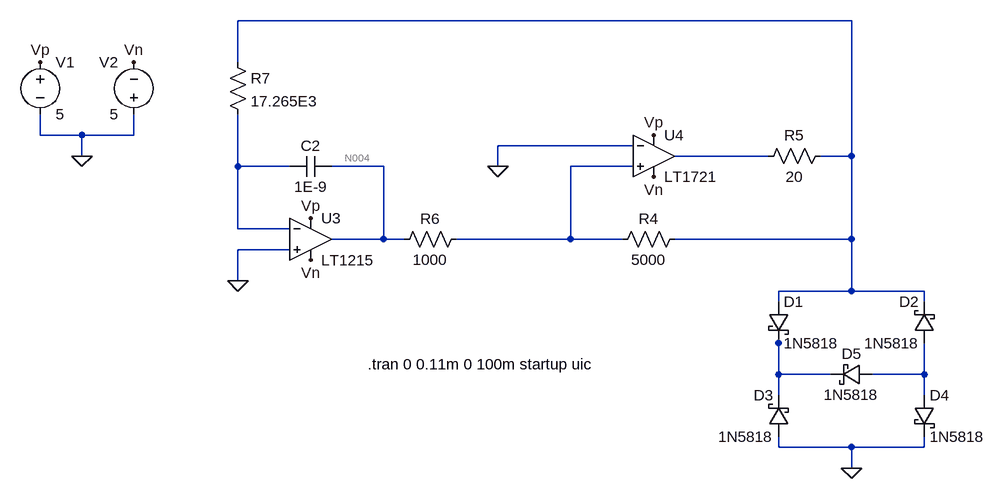
[diagram p0: schematic multivibrator.asc]
multivibrator.asc, the LTspice schematic file:
Version 4
SHEET 1 2040 680
WIRE 784 -80 -160 -80
WIRE -160 -16 -160 -80
WIRE -464 96 -464 64
WIRE -400 96 -464 96
WIRE -320 96 -320 64
WIRE -320 96 -400 96
WIRE 448 112 240 112
WIRE -400 128 -400 96
WIRE 656 128 512 128
WIRE 784 128 784 -80
WIRE 784 128 736 128
WIRE -160 144 -160 64
WIRE -80 144 -160 144
WIRE 64 144 -16 144
WIRE 240 144 240 112
WIRE 448 144 352 144
WIRE -160 240 -160 144
WIRE -80 240 -160 240
WIRE 64 256 64 144
WIRE 64 256 -16 256
WIRE 96 256 64 256
WIRE 352 256 352 144
WIRE 352 256 176 256
WIRE 432 256 352 256
WIRE 784 256 784 128
WIRE 784 256 512 256
WIRE -80 272 -160 272
WIRE -160 320 -160 272
WIRE 784 336 784 256
WIRE 784 336 672 336
WIRE 896 336 784 336
WIRE 672 352 672 336
WIRE 896 352 896 336
WIRE 672 416 672 400
WIRE 672 464 672 416
WIRE 752 464 672 464
WIRE 896 464 896 416
WIRE 896 464 816 464
WIRE 672 496 672 464
WIRE 896 496 896 464
WIRE 672 576 672 560
WIRE 784 576 672 576
WIRE 896 576 896 560
WIRE 896 576 784 576
WIRE 784 608 784 576
FLAG -400 128 0
FLAG -464 -16 Vp
FLAG -320 -16 Vn
FLAG 240 144 0
FLAG -160 320 0
FLAG -48 224 Vp
FLAG 480 96 Vp
FLAG -48 288 Vn
FLAG 480 160 Vn
FLAG 784 608 0
SYMBOL voltage -464 -32 R0
SYMATTR InstName V1
SYMATTR Value 5
SYMBOL voltage -320 80 R180
WINDOW 0 24 96 Left 2
WINDOW 3 24 16 Left 2
SYMATTR InstName V2
SYMATTR Value 5
SYMBOL res 528 240 R90
WINDOW 0 0 56 VBottom 2
WINDOW 3 32 56 VTop 2
SYMATTR InstName R4
SYMATTR Value 5000
SYMBOL res 752 112 R90
WINDOW 0 0 56 VBottom 2
WINDOW 3 32 56 VTop 2
SYMATTR InstName R5
SYMATTR Value 20
SYMBOL res 192 240 R90
WINDOW 0 0 56 VBottom 2
WINDOW 3 32 56 VTop 2
SYMATTR InstName R6
SYMATTR Value 1000
SYMBOL Opamps\\LT1215 -48 192 R0
SYMATTR InstName U3
SYMBOL cap -16 128 R90
WINDOW 0 0 32 VBottom 2
WINDOW 3 32 32 VTop 2
SYMATTR InstName C2
SYMATTR Value 1E-9
SYMBOL res -176 -32 R0
SYMATTR InstName R7
SYMATTR Value 17.265E3
SYMBOL schottky 656 352 R0
SYMATTR InstName D1
SYMATTR Value 1N5818
SYMATTR Description Diode
SYMATTR Type diode
SYMBOL schottky 912 416 R180
WINDOW 0 24 64 Left 2
WINDOW 3 24 0 Left 2
SYMATTR InstName D2
SYMATTR Value 1N5818
SYMATTR Description Diode
SYMATTR Type diode
SYMBOL schottky 688 560 R180
WINDOW 0 24 64 Left 2
WINDOW 3 24 0 Left 2
SYMATTR InstName D3
SYMATTR Value 1N5818
SYMATTR Description Diode
SYMATTR Type diode
SYMBOL schottky 880 496 R0
SYMATTR InstName D4
SYMATTR Value 1N5818
SYMATTR Description Diode
SYMATTR Type diode
SYMBOL schottky 816 448 R90
WINDOW 0 0 32 VBottom 2
WINDOW 3 32 32 VTop 2
SYMATTR InstName D5
SYMATTR Value 1N5818
SYMATTR Description Diode
SYMATTR Type diode
SYMBOL Comparators\\LT1721 480 64 R0
SYMATTR InstName U4
TEXT 40 448 Left 2 !.tran 0 0.11m 0 100m startup uic

The netlist it stands for:
* multivibrator.asc
V1 Vp 0 5
V2 0 Vn 5
R4 N001 N005 5000
R5 N001 N002 20
R6 N005 N004 1000
XU3 0 N003 Vp Vn N004 LT1215  ; pins In+ In- V+ V- OUT
C2 N004 N003 1E-9
R7 N001 N003 17.265E3
D1 N001 N006 1N5818
D2 N007 N001 1N5818
D3 0 N006 1N5818
D4 N007 0 1N5818
D5 N007 N006 1N5818
XU4 N005 0 Vp Vn N002 LT1720  ; LT1721, pins In+ In- V+ V- OUT
.model D D
.lib standard.dio
.tran 0 0.11m 0 100m startup uic
.lib LTC.lib
.backanno
.end

* Results of the author's LTspice run, read from the files saved beside the schematic
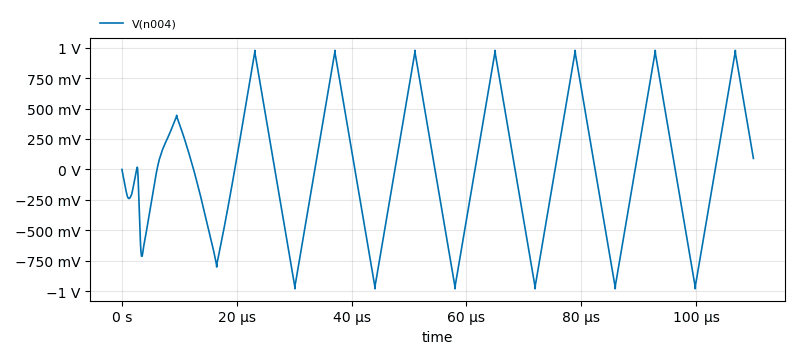
[diagram p1: Transient Analysis of multivibrator.asc, plotted from the saved traces]
* Transient Analysis, 1 run:
*   V(n004): min -979.7 mV, max 977.3 mV, average 3.544 mV, rms 545.5 mV, last 90.35 mV